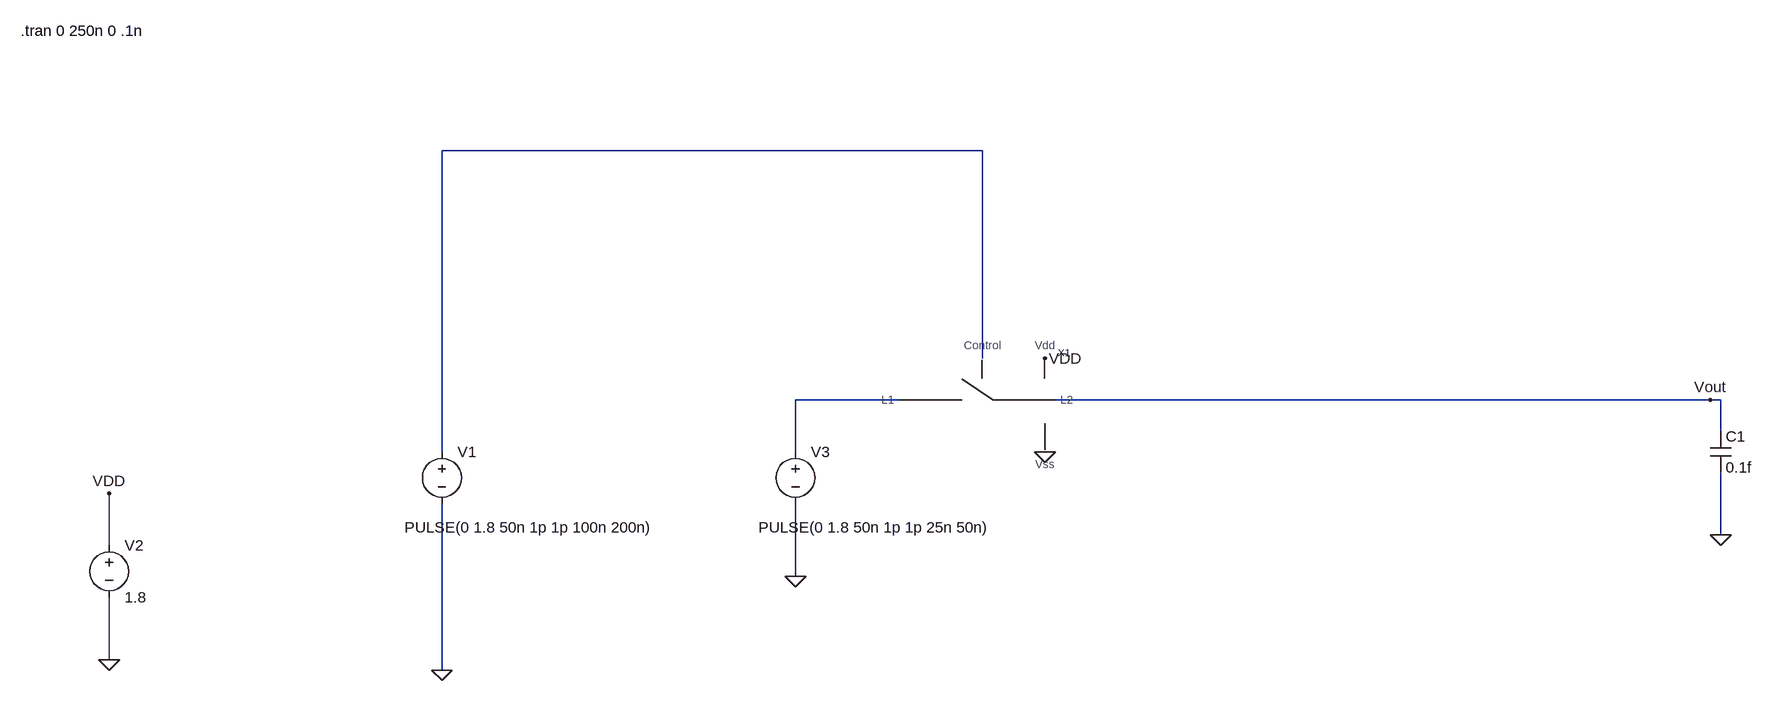
[diagram p0: schematic LLAVE_TB.asc]
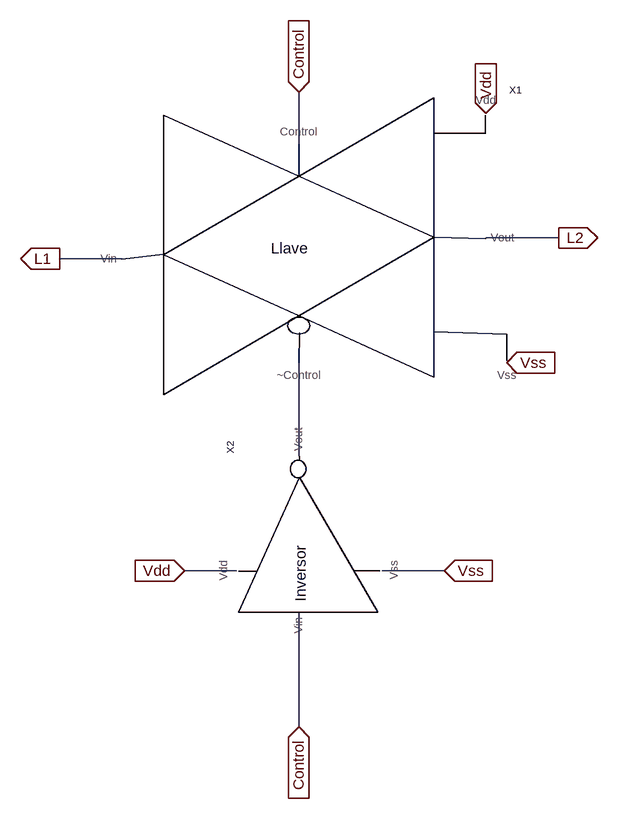
[diagram p1: sub-circuit llave.asc]
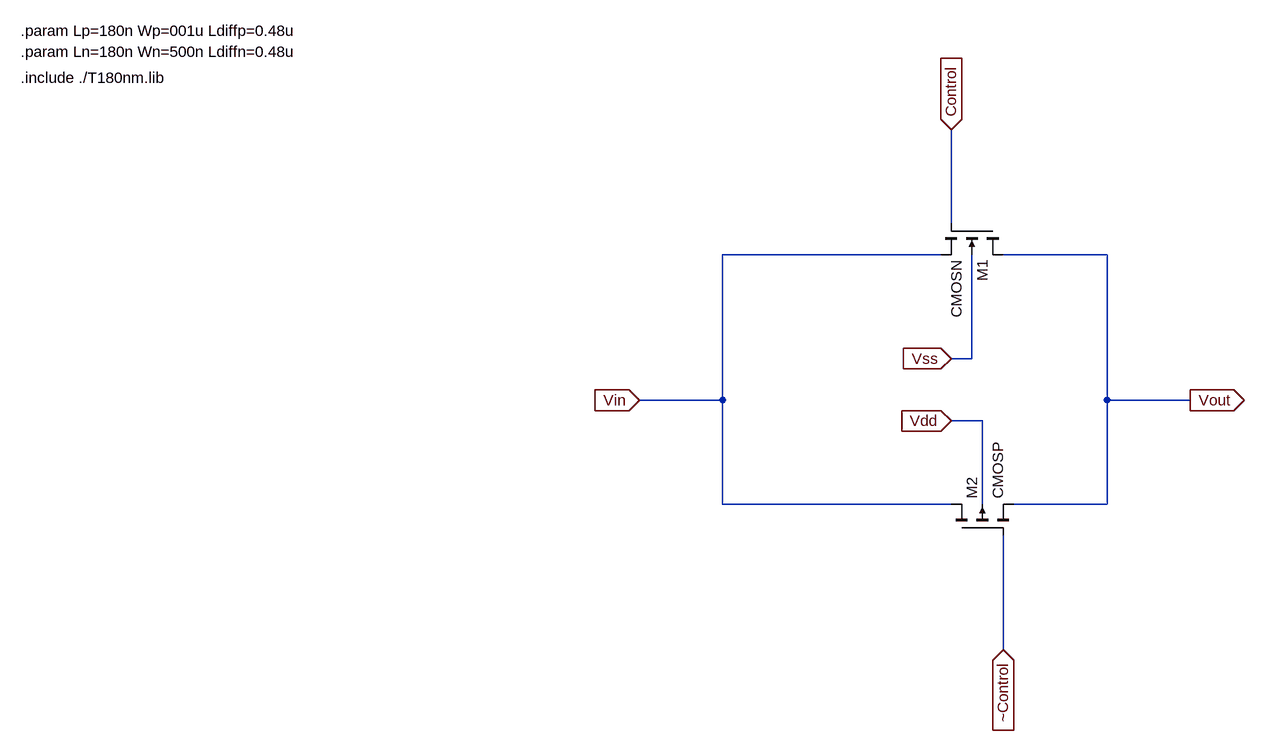
[diagram p2: sub-circuit transgate.asc]
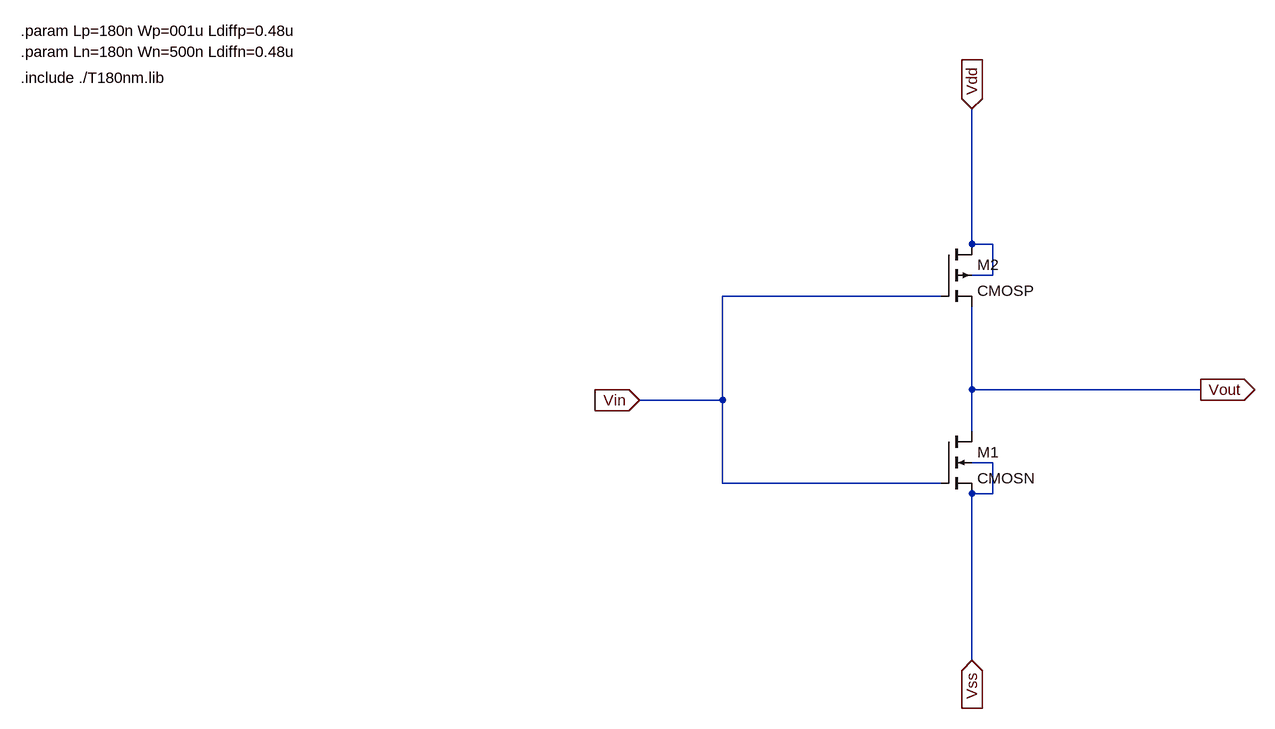
[diagram p3: sub-circuit inversor.asc]
LLAVE_TB.asc, the LTspice schematic file:
Version 4
SHEET 1 1432 1476
WIRE 240 -272 -592 -272
WIRE 240 48 240 -272
WIRE 112 112 -48 112
WIRE 1360 112 352 112
WIRE 1376 112 1360 112
WIRE 1376 160 1376 112
WIRE -592 192 -592 -272
WIRE -48 192 -48 112
WIRE 1376 320 1376 224
WIRE -1104 336 -1104 256
WIRE -48 384 -48 272
WIRE -1104 512 -1104 416
WIRE -592 528 -592 272
FLAG -1104 512 0
FLAG -592 528 0
FLAG -1104 256 VDD
FLAG 1360 112 Vout
FLAG 1376 320 0
FLAG -48 384 0
FLAG 336 48 VDD
FLAG 336 192 0
SYMBOL voltage -592 176 R0
WINDOW 3 -57 132 Left 2
WINDOW 123 0 0 Left 2
WINDOW 39 0 0 Left 2
SYMATTR Value PULSE(0 1.8 50n 1p 1p 100n 200n)
SYMATTR InstName V1
SYMBOL voltage -1104 320 R0
WINDOW 123 0 0 Left 2
WINDOW 39 0 0 Left 2
SYMATTR InstName V2
SYMATTR Value 1.8
SYMBOL cap 1360 160 R0
SYMATTR InstName C1
SYMATTR Value 0.1f
SYMBOL llave 240 112 R0
SYMATTR InstName X1
SYMBOL voltage -48 176 R0
WINDOW 3 -57 132 Left 2
WINDOW 123 0 0 Left 2
WINDOW 39 0 0 Left 2
SYMATTR Value PULSE(0 1.8 50n 1p 1p 25n 50n)
SYMATTR InstName V3
TEXT -1240 -456 Left 2 !.tran 0 250n 0 .1n

llave.asc, the sub-circuit schematic file:
Version 4
SHEET 1 880 1248
WIRE 48 208 48 128
WIRE 448 352 336 352
WIRE -224 384 -320 384
WIRE 48 688 48 544
WIRE -48 864 -128 864
WIRE 272 864 176 864
WIRE 48 1104 48 928
FLAG -320 384 L1
IOPIN -320 384 Out
FLAG 448 352 L2
IOPIN 448 352 Out
FLAG 48 128 Control
IOPIN 48 128 In
FLAG -128 864 Vdd
IOPIN -128 864 In
FLAG 272 864 Vss
IOPIN 272 864 In
FLAG 48 1104 Control
IOPIN 48 1104 In
FLAG 368 544 Vss
IOPIN 368 544 In
FLAG 336 160 Vdd
IOPIN 336 160 In
SYMBOL transgate 32 368 R0
SYMATTR InstName X1
SYMBOL inversor 48 864 R270
SYMATTR InstName X2

transgate.asc, the sub-circuit schematic file:
Version 4
SHEET 1 880 712
WIRE 192 -128 192 -272
WIRE 176 -80 -160 -80
WIRE 432 -80 272 -80
WIRE 224 80 224 -80
WIRE 224 80 192 80
WIRE -160 144 -160 -80
WIRE -160 144 -288 144
WIRE 432 144 432 -80
WIRE 560 144 432 144
WIRE 240 176 192 176
WIRE -160 304 -160 144
WIRE 192 304 -160 304
WIRE 240 304 240 176
WIRE 432 304 432 144
WIRE 432 304 288 304
WIRE 272 528 272 352
FLAG -288 144 Vin
IOPIN -288 144 In
FLAG 560 144 Vout
IOPIN 560 144 Out
FLAG 192 -272 Control
IOPIN 192 -272 In
FLAG 272 528 ~Control
IOPIN 272 528 In
FLAG 192 176 Vdd
IOPIN 192 176 In
FLAG 192 80 Vss
IOPIN 192 80 In
SYMBOL nmos4 272 -128 R90
SYMATTR InstName M1
SYMATTR Value CMOSN
SYMATTR Value2 l={Ln} w={Wn} ad={Ldiffn*Wn} as={Ldiffn*Wn} pd={2*Ldiffn+Wn} ps={2*Ldiffn+Wn}
SYMBOL pmos4 192 352 R270
SYMATTR InstName M2
SYMATTR Value CMOSP
SYMATTR Value2 l={Lp} w={Wp} ad={Ldiffp*Wp} as={Ldiffp*Wp} pd={2*Ldiffp+Wp} ps={2*Ldiffp+Wp}
TEXT -1240 -352 Left 2 !.include ./T180nm.lib
TEXT -1240 -424 Left 2 !.param Lp=180n Wp=001u Ldiffp=0.48u
TEXT -1240 -392 Left 2 !.param Ln=180n Wn=500n Ldiffn=0.48u

inversor.asc, the sub-circuit schematic file:
Version 4
SHEET 1 880 712
WIRE 224 -96 224 -304
WIRE 256 -96 224 -96
WIRE 256 -48 256 -96
WIRE 256 -48 224 -48
WIRE 176 -16 -160 -16
WIRE 224 128 224 0
WIRE 576 128 224 128
WIRE -160 144 -160 -16
WIRE -160 144 -288 144
WIRE 224 192 224 128
WIRE 256 240 224 240
WIRE -160 272 -160 144
WIRE 176 272 -160 272
WIRE 256 288 256 240
WIRE 256 288 224 288
WIRE 224 544 224 288
FLAG -288 144 Vin
IOPIN -288 144 In
FLAG 576 128 Vout
IOPIN 576 128 Out
FLAG 224 -304 Vdd
IOPIN 224 -304 In
FLAG 224 544 Vss
IOPIN 224 544 In
SYMBOL nmos4 176 192 R0
SYMATTR InstName M1
SYMATTR Value CMOSN
SYMATTR Value2 l={Ln} w={Wn} ad={Ldiffn*Wn} as={Ldiffn*Wn} pd={2*Ldiffn+Wn} ps={2*Ldiffn+Wn}
SYMBOL pmos4 176 -96 R0
SYMATTR InstName M2
SYMATTR Value CMOSP
SYMATTR Value2 l={Lp} w={Wp} ad={Ldiffp*Wp} as={Ldiffp*Wp} pd={2*Ldiffp+Wp} ps={2*Ldiffp+Wp}
TEXT -1240 -352 Left 2 !.include ./T180nm.lib
TEXT -1240 -424 Left 2 !.param Lp=180n Wp=001u Ldiffp=0.48u
TEXT -1240 -392 Left 2 !.param Ln=180n Wn=500n Ldiffn=0.48u

The netlist it stands for:
* LLAVE_TB.asc
V1 N001 0 PULSE(0 1.8 50n 1p 1p 100n 200n)
V2 VDD 0 1.8
C1 Vout 0 0.1f
XX1 N002 N001 0 Vout VDD llave
V3 N002 0 PULSE(0 1.8 50n 1p 1p 25n 50n)

* block symbol definitions
.subckt llave L1 Control Vss L2 Vdd
XX1 L1 Vdd Vss L2 Control N001 transgate
XX2 Control Vdd Vss N001 inversor
.ends llave

.subckt transgate Vin Vdd Vss Vout Control ~Control
M1 Vout Control Vin Vss CMOSN l={Ln} w={Wn} ad={Ldiffn*Wn} as={Ldiffn*Wn} pd={2*Ldiffn+Wn} ps={2*Ldiffn+Wn}
M2 Vin ~Control Vout Vdd CMOSP l={Lp} w={Wp} ad={Ldiffp*Wp} as={Ldiffp*Wp} pd={2*Ldiffp+Wp} ps={2*Ldiffp+Wp}
.include ./T180nm.lib
.param Lp=180n Wp=001u Ldiffp=0.48u
.param Ln=180n Wn=500n Ldiffn=0.48u
.ends transgate

.subckt inversor Vin Vdd Vss Vout
M1 Vout Vin Vss Vss CMOSN l={Ln} w={Wn} ad={Ldiffn*Wn} as={Ldiffn*Wn} pd={2*Ldiffn+Wn} ps={2*Ldiffn+Wn}
M2 Vdd Vin Vout Vdd CMOSP l={Lp} w={Wp} ad={Ldiffp*Wp} as={Ldiffp*Wp} pd={2*Ldiffp+Wp} ps={2*Ldiffp+Wp}
.include ./T180nm.lib
.param Lp=180n Wp=001u Ldiffp=0.48u
.param Ln=180n Wn=500n Ldiffn=0.48u
.ends inversor

.model NMOS NMOS
.model PMOS PMOS
.lib standard.mos
.tran 0 250n 0 .1n
.backanno
.end